# Altium schematic sheet Prometheus-Schematic-V1.SchDoc: PROMETHEUS 9000
size C; DrawnBy: ERNEST HOVHANNISYAN
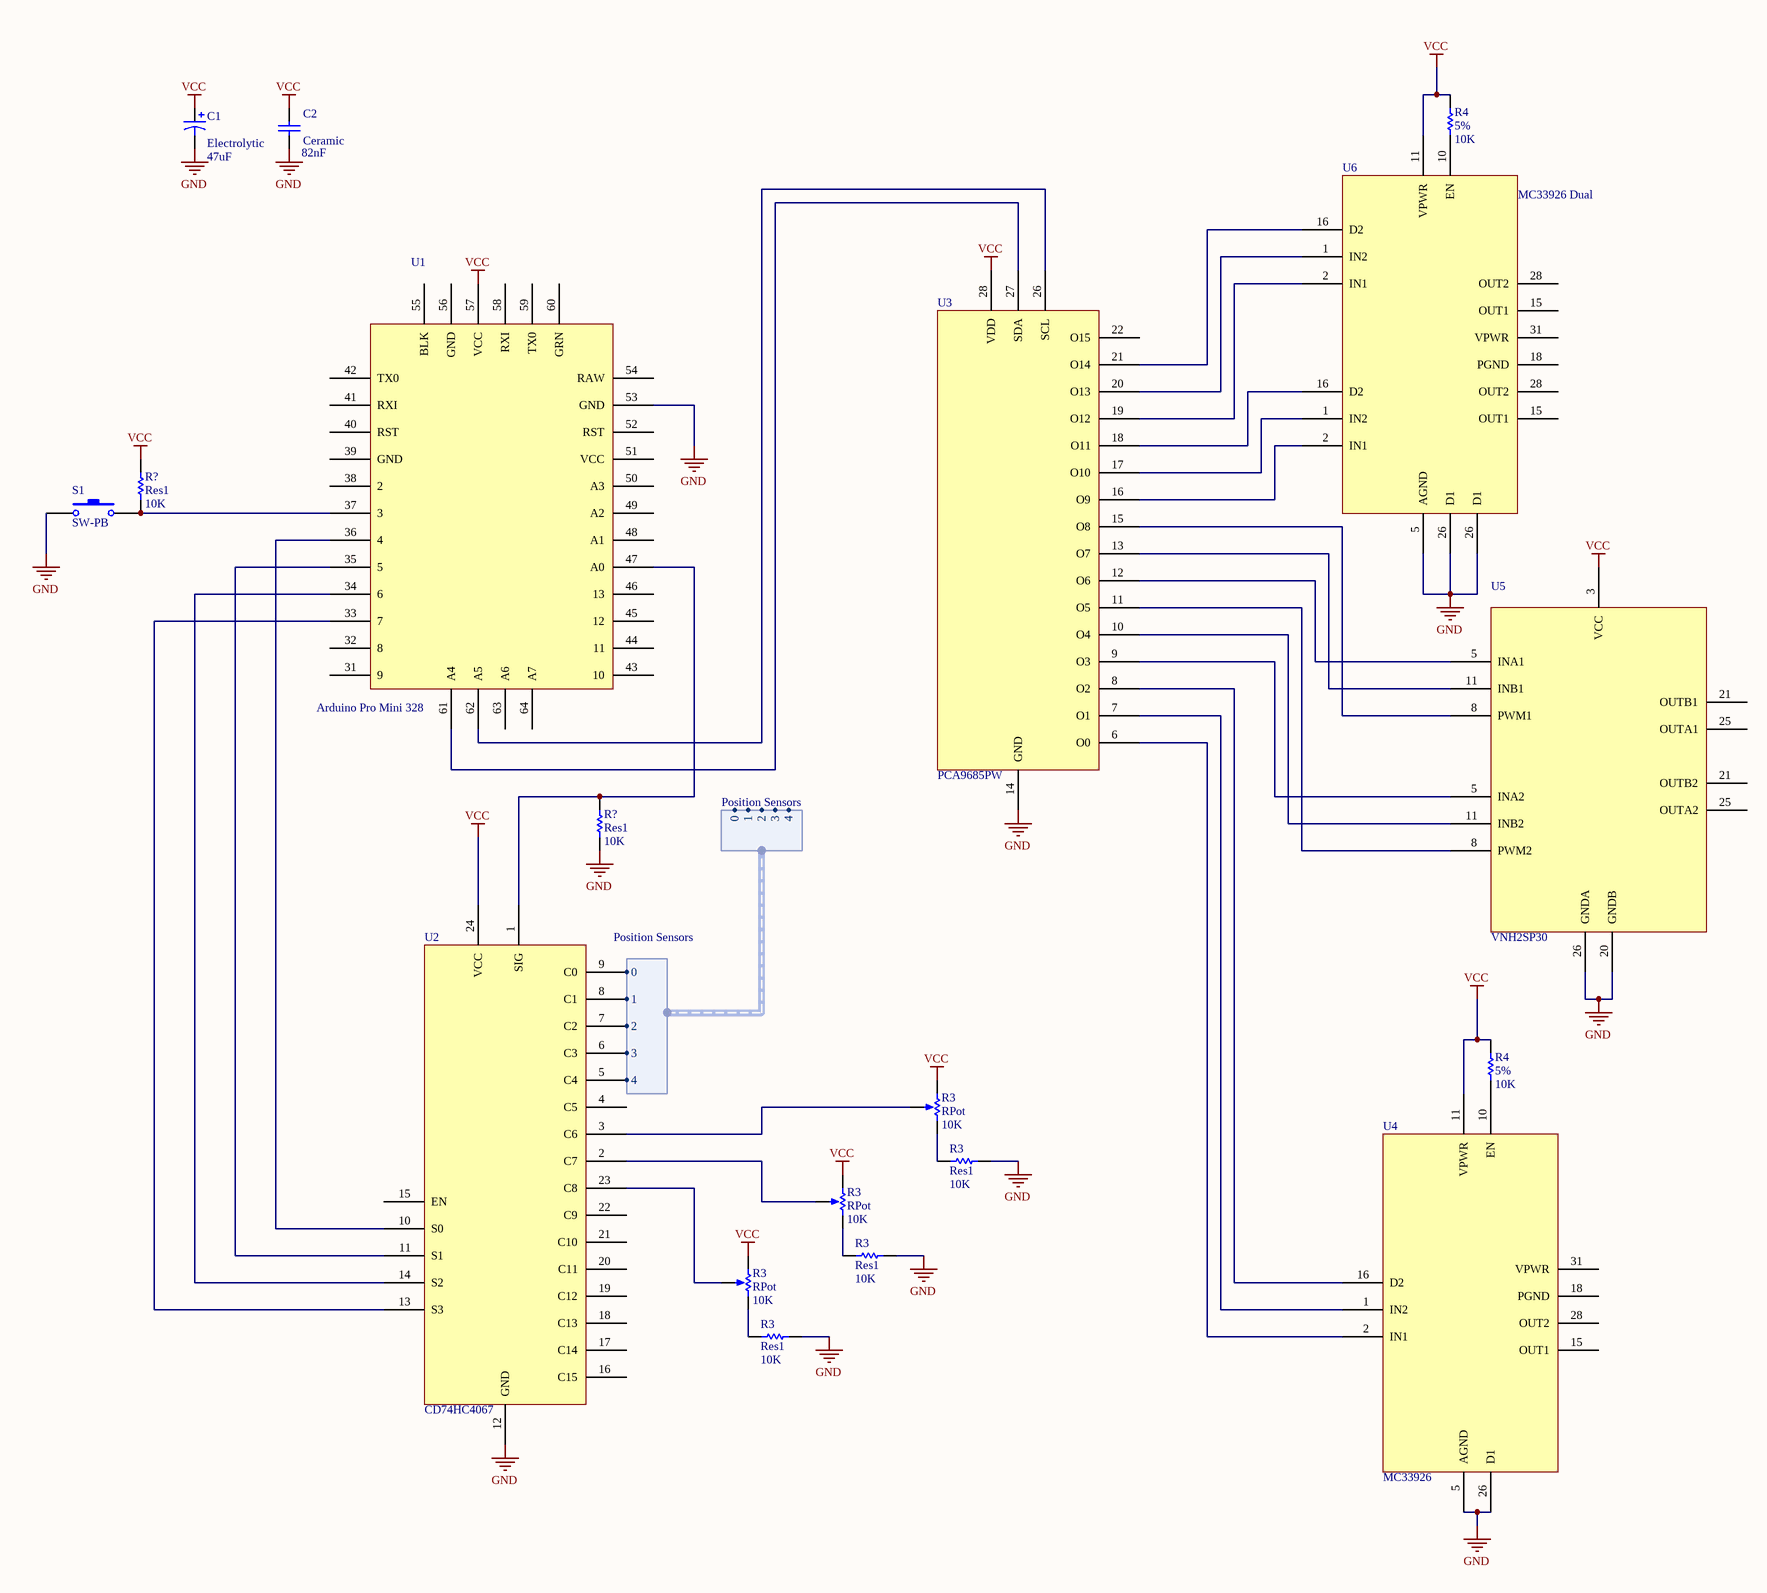
[diagram p0: Prometheus-Schematic-V1.SchDoc]

## Parts
(Parts that share a designator on the sheet are numbered #1, #2 ... from top to bottom, then left to right.)
C1  Electrolytic  value 47uF  [RB7.6-15]
C2  Ceramic  value 82nF  [RAD-0.3]
R3#1  RPot  value 10K  [VR5]
R3#2  Res1  value 10K  [AXIAL-0.3]
R3#3  RPot  value 10K  [VR5]
R3#4  Res1  value 10K  [AXIAL-0.3]
R3#5  RPot  value 10K  [VR5]
R3#6  Res1  value 10K  [AXIAL-0.3]
R4#1  5%  value 10K  [AXIAL-0.3]
R4#2  5%  value 10K  [AXIAL-0.3]
R?#1  Res1  value 10K  [AXIAL-0.3]
R?#2  Res1  value 10K  [AXIAL-0.3]
S1  SW-PB  [SPST-2]
U1  Arduino Pro Mini 328  [TQFP80P900X900X120-32N]
U2  CD74HC4067
U3  PCA9685PW
U4  MC33926
U5  VNH2SP30
U6  MC33926 Dual

## Harnesses
Position Sensors: 0, 1, 2, 3, 4

## Nets
GND: C1.2 C2.1 R3#2.2 R3#4.2 R3#6.2 R?#2.2 S1.1 U1.53(GND) U2.12(GND) U3.14(GND) U4.5(AGND) U4.26(D1) U5.20(GNDB) U5.26(GNDA) U6.5(AGND) U6.26(D1)
VCC: C1.1 C2.2 R3#1.1(TOP) R3#3.1(TOP) R3#5.1(TOP) R4#1.1 R4#2.1 R?#1.2 U1.57(VCC) U2.24(VCC) U3.28(VDD) U4.11(VPWR) U5.3(VCC) U6.11(VPWR)
NetR3#1_2: R3#1.2(BOT) R3#2.1
NetR3#1_3: R3#1.3(TAP) U2.3(C6)
NetR3#3_2: R3#3.2(BOT) R3#4.1
NetR3#3_3: R3#3.3(TAP) U2.2(C7)
NetR3#5_2: R3#5.2(BOT) R3#6.1
NetR3#5_3: R3#5.3(TAP) U2.23(C8)
NetR4#2_2: R4#2.2 U4.10(EN)
NetR?#1_1: R?#1.1 S1.2 U1.37(3)
NetR?#2_1: R?#2.1 U1.47(A0) U2.1(SIG)
NetU1_33: U1.33(7) U2.13(S3)
NetU1_34: U1.34(6) U2.14(S2)
NetU1_35: U1.35(5) U2.11(S1)
NetU1_36: U1.36(4) U2.10(S0)
NetU1_61: U1.61(A4) U3.27(SDA)
NetU1_62: U1.62(A5) U3.26(SCL)
NetU2_5: U2.5(C4) ; harness Position Sensors.4
NetU2_6: U2.6(C3) ; harness Position Sensors.3
NetU2_7: U2.7(C2) ; harness Position Sensors.2
NetU2_8: U2.8(C1) ; harness Position Sensors.1
NetU2_9: U2.9(C0) ; harness Position Sensors.0
NetU3_6: U3.6(O0) U4.2(IN1)
NetU3_7: U3.7(O1) U4.1(IN2)
NetU3_8: U3.8(O2) U4.16(D2)
NetU3_9: U3.9(O3) U5.5(INA2)
NetU3_10: U3.10(O4) U5.11(INB2)
NetU3_11: U3.11(O5) U5.8(PWM2)
NetU3_12: U3.12(O6) U5.5(INA1)
NetU3_13: U3.13(O7) U5.11(INB1)
NetU3_15: U3.15(O8) U5.8(PWM1)
NetU3_16: U3.16(O9) U6.2(IN1)
NetU3_17: U3.17(O10) U6.1(IN2)
NetU3_18: U3.18(O11) U6.16(D2)
NetU3_19: U3.19(O12) U6.2(IN1)
NetU3_20: U3.20(O13) U6.1(IN2)
NetU3_21: U3.21(O14) U6.16(D2)

Not connected (* = marked no-connect by the designer): R4#1 2; U1 31(9) 32(8) 38(2) 39(GND) 40(RST) 41(RXI) 42(TX0) 43(10) 44(11) 45(12) 46(13) 48(A1) 49(A2) 50(A3) 51(VCC) 52(RST) 54(RAW) 55(BLK) 56(GND) 58(RXI) 59(TX0) 60(GRN) 63(A6) 64(A7); U2 4(C5) 15(EN) 16(C15) 17(C14) 18(C13) 19(C12) 20(C11) 21(C10) 22(C9); U3 22(O15); U4 15(OUT1) 18(PGND) 28(OUT2) 31(VPWR); U5 21(OUTB1) 25(OUTA1); U6 10(EN) 15(OUT1) 18(PGND) 28(OUT2) 31(VPWR)

## Library data of the parts
C1 = Cap Pol1: Polarized Capacitor (Radial); Published: 8-Jun-2000; LatestRevisionDate: 17-Jul-2002; LatestRevisionNote: Re-released for DXP Platform.; PackageReference: RB7.6-15; Publisher: Altium Limited; PackageDescription: Polarized Capacitor (Radial); 2 Leads
C2 = Cap: Capacitor; Published: 8-Jun-2000; LatestRevisionDate: 17-Jul-2002; LatestRevisionNote: Re-released for DXP Platform.; PackageReference: RAD-0.3; Publisher: Altium Limited; PackageDescription: Radial Cap, Thru-Hole; 2 Leads; 0.3 in Pin Spacing
R3#1 R3#3 R3#5 = RPot: Potentiometer; Sim Note: Enter the Resistance value and the set point into parameter fields.; Set Position: 0.5; Published: 8-Jun-2000; LatestRevisionDate: 17-Jul-2002; LatestRevisionNote: Re-released for DXP Platform.; PackageReference: VR5; Publisher: Altium Limited; PackageDescription: Variable Resistor, Thru-Hole; 3 Leads
R3#2 R3#4 R3#6 R4#1 R4#2 R?#1 R?#2 = Res1: Resistor; Published: 8-Jun-2000; LatestRevisionDate: 17-Jul-2002; LatestRevisionNote: Re-released for DXP Platform.; PackageReference: AXIAL-0.3; Publisher: Altium Limited; PackageDescription: Axial Device, Thru-Hole; 2 Leads; 0.3 in Pin Spacing
S1 = SW-PB: Switch; Published: 24-Mar-1999; LatestRevisionDate: 17-Jul-2002; LatestRevisionNote: Re-released for DXP Platform.; PackageReference: SPST-2; Publisher: Altium Limited; PackageDescription: Switch; 2 Leads
U1-U6 = Component_1
  U2: DigiKey: 296-9226-1-ND